# Altium schematic sheet 槽型光电-MG版本.SchDoc
size A2
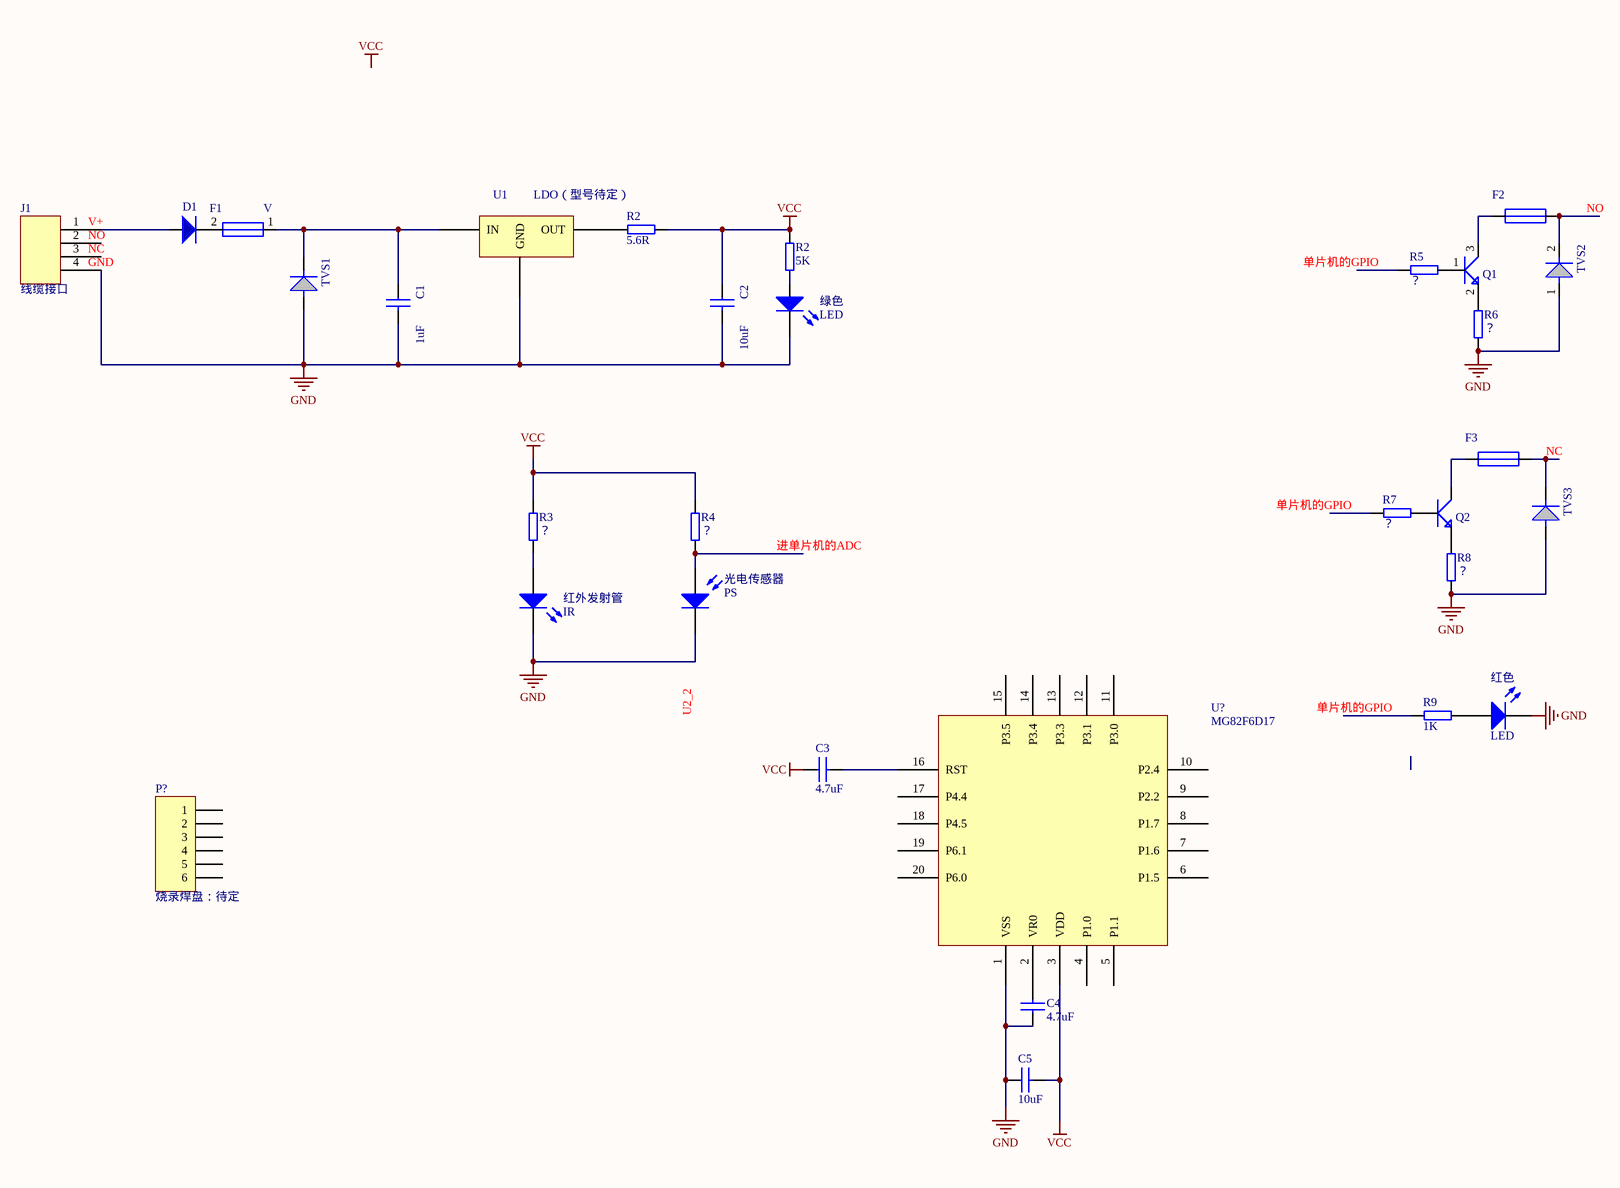
[diagram p0: 槽型光电-MG版本.SchDoc]

## Parts
(Parts that share a designator on the sheet are numbered #1, #2 ... from top to bottom, then left to right.)
C1  1uF  [1206]
C2  10uF  [1206]
C3  4.7uF  [1206]
C4  4.7uF  [1206]
C5  10uF  [1206]
D1  (no value)
F1  V  [0805]
F2  V  [0805]  (value not drawn)
F3  (no value)  [0805]
J1  线缆接口  [SIP4]
P?  烧录焊盘：待定  [HDR1X6]
Q1  2SC4617TLR  (value not drawn)
Q2  2SC4617TLR  (value not drawn)
R2#1  5.6R
R2#2  5K
R3  ？
R4  ？
R5  ？
R6  ？
R7  ？
R8  ？
R9  1K
TVS1  M1  [1206]  (value not drawn)
TVS2  (no value)  [1206]
TVS3  (no value)  [1206]
U1  LDO（型号待定）  [SOT89]
U?  MG82F6D17
光电传感器  PS  [PIN2]
红外发射管  IR  [LED-0]
红色  LED  [LED-0]
绿色  LED  [LED-0]

## Nets
GND: C1.2 C2.2 C4.1 C5.1 J1.4 R6.2 R8.2 TVS1.1 TVS2.1 TVS3.1 U1.2(GND) U?.1(VSS) 光电传感器.2(K) 红外发射管.2(K) 红色.2(K) 绿色.2(K)
VCC: C2.1 C3.1 C5.2 R2#1.1 R2#2.1 R3.1 R4.1 U?.3(VDD)
NetC1_1: C1.1 F1.1 TVS1.2 U1.3(IN)
NetC3_2: C3.2 U?.16(RST)
NetC4_2: C4.2 U?.2(VR0)
NetD1_1: D1.1 J1.1
NetD1_2: D1.2 F1.2
NetF2_1: F2.1 TVS2.2
NetF2_2: F2.2 Q1.3(C)
NetF3_1: F3.1 TVS3.2
NetF3_2: F3.2 Q2.3(C)
NetQ1_1: Q1.1(B) R5.2
NetQ1_2: Q1.2(E) R6.1
NetQ2_1: Q2.1(B) R7.2
NetQ2_2: Q2.2(E) R8.1
NetR2#1_2: R2#1.2 U1.1(OUT)
NetR2#2_2: R2#2.2 绿色.1(A)
NetR3_2: R3.2 红外发射管.1(A)
NetR4_2: R4.2 光电传感器.1(A)
NetR9_2: R9.2 红色.1(A)

Not connected (* = marked no-connect by the designer): J1 2 3; P? 1 2 3 4 5 6; R5 1; R7 1; R9 1; U? 4(P1.0) 5(P1.1) 6(P1.5) 7(P1.6) 8(P1.7) 9(P2.2) 10(P2.4) 11(P3.0) 12(P3.1) 13(P3.3) 14(P3.4) 15(P3.5) 17(P4.4) 18(P4.5) 19(P6.1) 20(P6.0)

## Notes on the sheet
- (near J1) V+
- (near J1) NO
- (near J1) NC
- NO
- (near J1) GND
- 单片机的GPIO
- NC
- 进单片机的ADC
- U2_2
- Labels drawn without touching a wire or pin: VCC

## Library data of the parts
C1-C5 = CAP NP: Text Field1: 20; Text Field2: 10
D1 = D
F1-F3 = FUSE_0: Text Field1: 30; Text Field2: 20
J1 = 4H
P? = Header 6: Header, 6-Pin; LatestRevisionDate: 17-Jul-2002; LatestRevisionNote: Re-released for DXP Platform.; Publisher: Altium Limited
Q1 Q2 = 2SC4617
R2#1 R2#2 R3-R9 = RES
TVS1-TVS3 = D1N3063_0: Text Field1: 20; Text Field2: 20
U1 = 78XX/SM_0: Text Field1: 70; Text Field2: 30
U? = MG82F6D17 QFN20
光电传感器 = Photo Sen: Photosensitive Diode; Published: 24-Mar-1999; LatestRevisionDate: 17-Jul-2002; LatestRevisionNote: Re-released for DXP Platform.; PackageReference: PIN2; Publisher: Altium Limited
红外发射管 红色 绿色 = LED0: Typical INFRARED GaAs LED; Published: 8-Jun-2000; LatestRevisionDate: 08-Jul-2005; LatestRevisionNote: Mech Layer 1 removed.; PackageReference: LED-0; Publisher: Altium Limited; PackageDescription: LED; 2 Leads